# Altium schematic sheet STM8S003F3.SchDoc
size A4; SheetNumber: 2; SheetTotal: 3
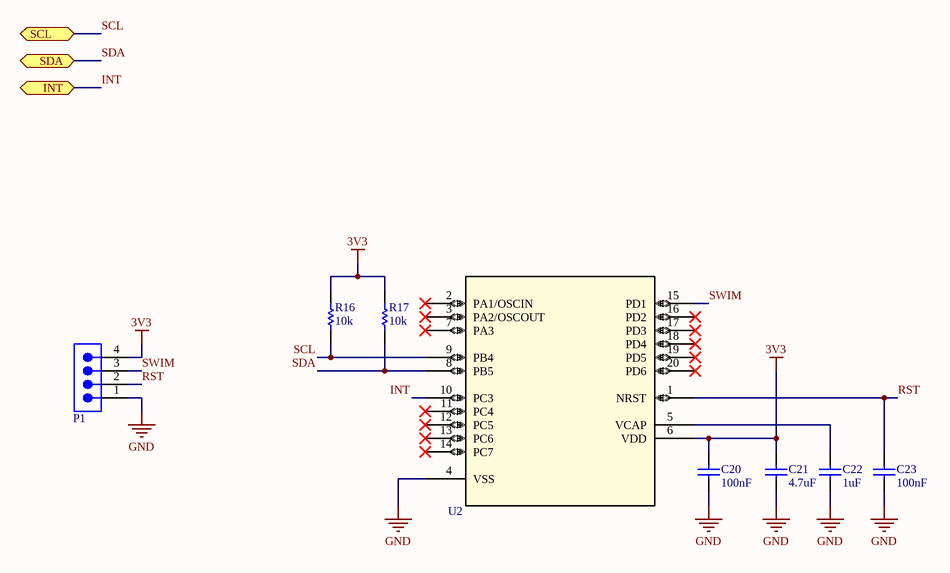
[diagram p0: STM8S003F3.SchDoc]

## Parts
C20  value 100nF  [Wurth 0603 capacitor]  (hidden comment: Generic Capacitor 100nF 0603)
C21  value 4.7uF  [Wurth 0603 capacitor]  (hidden comment: Generic Capacitor 4.7uF 0603)
C22  value 1uF  [Wurth 0603 capacitor]  (hidden comment: Generic Capacitor 1uF 0603)
C23  value 100nF  [Wurth 0603 capacitor]  (hidden comment: Generic Capacitor 100nF 0603)
P1  61300411121  [4x1 2.54mm M]  (value not drawn)
R16  value 10k  [Wurth 0603 Resistor]  (hidden comment: Generic Resistor 10k 0603)
R17  value 10k  [Wurth 0603 Resistor]  (hidden comment: Generic Resistor 10k 0603)
U2  STM8S003F3U6TR  [ST UFQFPN20]  (value not drawn)

## Ports
INT (bidir), SCL (bidir), SDA (bidir)

## Nets
3V3: C20.2 C21.2 P1.4 R16.2 R17.2 U2.6(VDD)
GND: C20.1 C21.1 C22.1 C23.1 P1.1 U2.4(VSS)
INT: U2.10(PC3) ; port INT
RST: C23.2 P1.2 U2.1(NRST)
SCL: R16.1 U2.9(PB4) ; port SCL
SDA: R17.1 U2.8(PB5) ; port SDA
SWIM: P1.3 U2.15(PD1)
NetC22_2: C22.2 U2.5(VCAP)

Not connected (* = marked no-connect by the designer): U2 2(PA1/OSCIN)* 3(PA2/OSCOUT)* 7(PA3)* 11(PC4)* 12(PC5)* 13(PC6)* 14(PC7)* 16(PD2)* 17(PD3)* 18(PD4)* 19(PD5)* 20(PD6)*

## Library data of the parts
P1 = 4P: WR-PHD Pin Header, THT, Vertical, pitch 2.54mm, 1 Row, 4P; Manufacturer: Wurth Elektronik; Contact Resistance: 20mOhm; Rated Current: 3A; Working Voltage: 250V; Withstanding Voltage: 500V; Manufacturer Part Number: 61300411121; Category: Board-to-Board Connectors; Match Code: WR-PHD; ComponentLink1Description: Website Link; ComponentLink1URL: https://www.we-online.com/redexpert/article/61300411121?ad; ComponentLink2Description: Datasheet Link; ComponentLink2URL: https://www.we-online.com/redexpert/spec/61300411121?ad; Mount: Through Hole; Operating Temperature Max: 105°C; Operating Temperature Min: -40°C; Packaging: Bag; Gender: Pin Header; Number of Pins: 4; Number of Rows: 1; Orientation: Vertical; Pitch: 2.54mm
U2 = STM8S003F3U6TR: Microcontroller, 8-Bit, FLASH, STM8S CPU, 16MHz, CMOS; Mfr_Name: STMicroelectronics; Number of I/O Lines: 16; Power Supplies: 3/5; Max Supply Current: 2.35mA; Max Supply Voltage: 5.5V; Min Supply Voltage: 2.95V; Nominal Supply Voltage: 5V; Peripherals: POR,WDT; Interface: I2C,SPI,UART; Qualification Status: Not Qualified; RefDes: RefDes; Type: Type; Supplier: Mouser; Supplier Part Number: 511-STM8S003F3U6TR; Manufacturer: STMicroelectronics; Manufacturer Part Number: STM8S003F3U6TR; RoHS: Yes; Category: Microcontrollers; Stock: 19718; Pricing: 1=0,8, 10=0,569, 50=0,513, 100=0,45, 1000=0,387, 10000=0,367 (USD); Case/Package: VQCCN; Pins: 20; Package Shape: Square; Min Operating Temperature: -40°C; Max Operating Temperature: 85°C; Clock Frequency: 16MHz; JESD-30 Code: S-XQCC-N20; Surface Mount: Yes; Technology: CMOS; Terminal Form: No Lead; Terminal Position: QUAD; Length: 3mm; Width: 3mm; Height - Seated (Max): 0.6mm; Terminal Pitch: 0.5mm; Temperature Grade: INDUSTRIAL; Reach SVHC Compliant: Yes; RoHS Compliant: Yes; ComponentLink1URL: https://datasheet.ciiva.com:443/pdfs/VipMasterIC/IC/SGST/SGST-S-A0006184982/SGST-S-A0006184982-1.pdf?src-supplier=IHS+Markit; ComponentLink1Description: https://datasheet.ciiva.com:443/pdfs/VipMasterIC/IC/SGST/SGST-S-A0006184982/SGST-S-A0006184982-1.pdf?src-supplier=IHS+Markit; ComponentLink2URL: https://datasheet.ciiva.com/28626/1690469-28626624.pdf?src-supplier=Element14; ComponentLink2Description: https://datasheet.ciiva.com/28626/1690469-28626624.pdf?src-supplier=Element14; ComponentLink3URL: https://datasheet.ciiva.com/6645/dm00024550-6645069.pdf?src-supplier=Digikey; ComponentLink3Description: https://datasheet.ciiva.com/6645/dm00024550-6645069.pdf?src-supplier=Digikey; ComponentLink4URL: https://datasheet.ciiva.com/9223/dm00024550-9223573.pdf?src-supplier=Avnet; ComponentLink4Description: https://datasheet.ciiva.com/9223/dm00024550-9223573.pdf?src-supplier=Avnet; ComponentLink5URL: https://datasheet.ciiva.com/13037/dm00024550-13037151.pdf?src-supplier=Mouser; ComponentLink5Description: https://datasheet.ciiva.com/13037/dm00024550-13037151.pdf?src-supplier=Mouser; ComponentLink6URL: https://datasheet.ciiva.com/16491/dm00024550-16491262.pdf?src-supplier=Future+Electronics; ComponentLink6Description: https://datasheet.ciiva.com/16491/dm00024550-16491262.pdf?src-supplier=Future+Electronics